# Altium project DCDCProto.PrjPCB
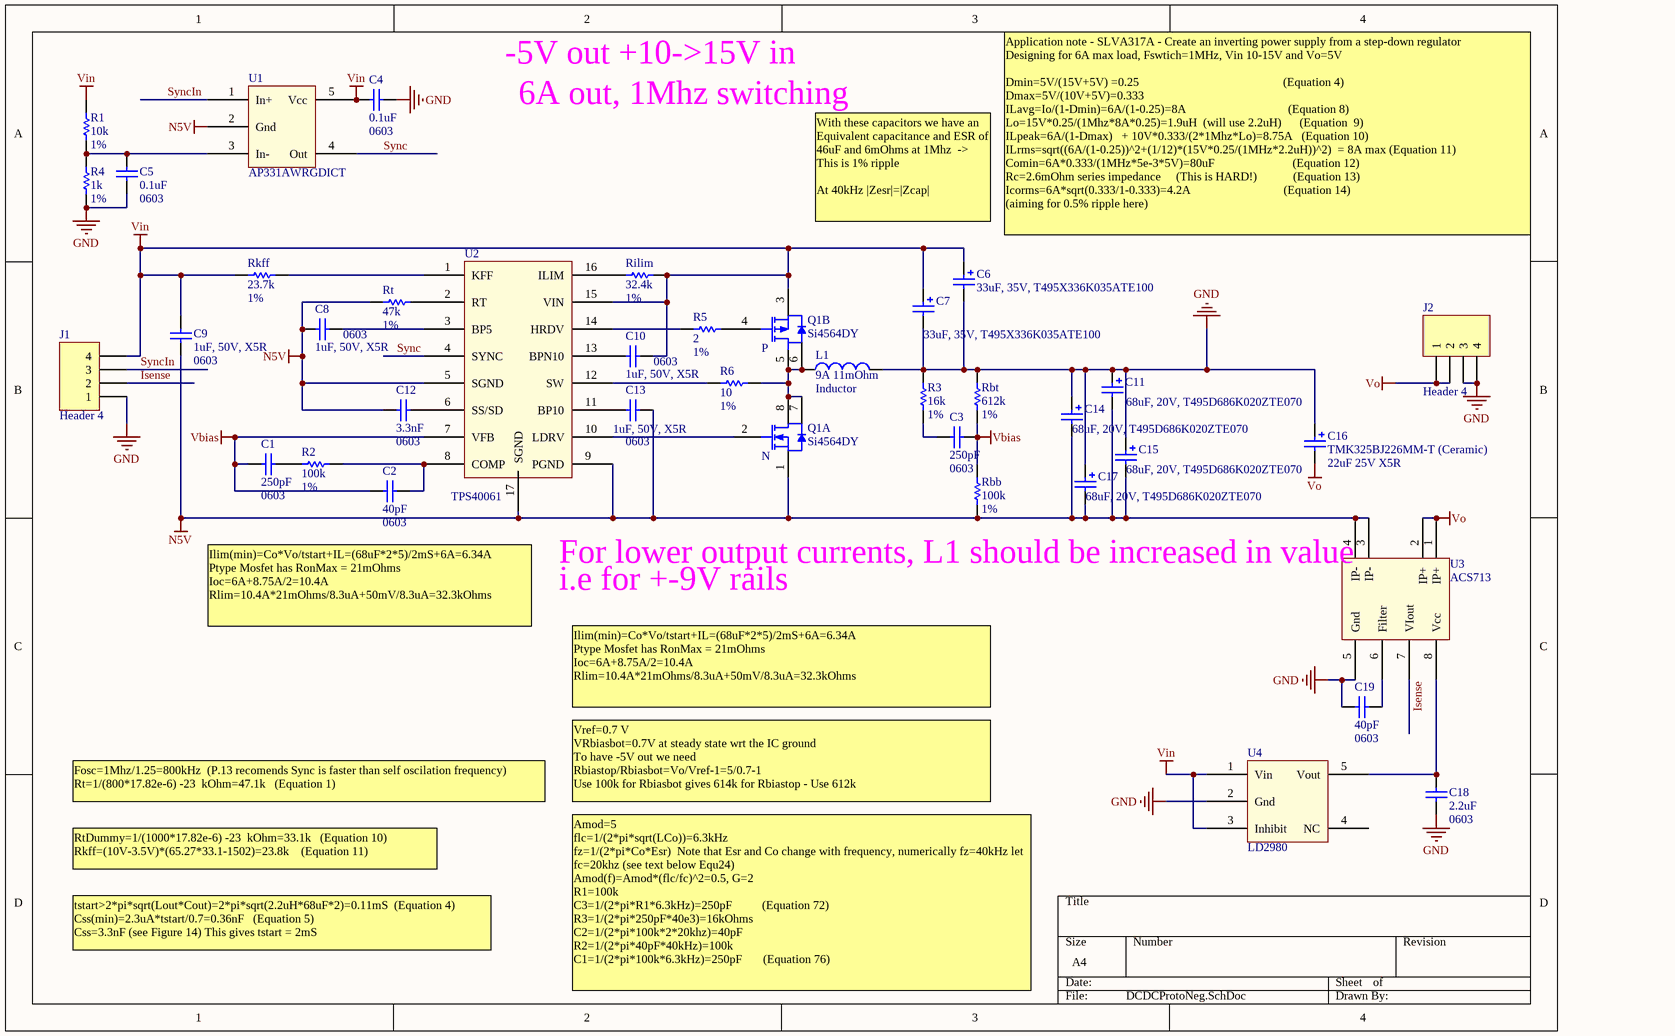
[diagram p0: DCDCProtoNeg.SchDoc]
2 sheets, 70 parts. Net scope: global (net labels, ports and power ports of the same name join across sheets).
Board file: DCDCProtoNeg.PcbDoc
Sheets:
  DCDCProtoNeg.SchDoc
  DCDCProtoPos.SchDoc

## Sheet DCDCProtoNeg.SchDoc
size A4

### Parts
(Parts that share a designator on the sheet are numbered #1, #2 ... from top to bottom, then left to right.)
C1#1  250pF  [0603]
C2#1  40pF  [0603]
C3#1  250pF  [0603]
C4#1  0.1uF  [0603]
C5  0.1uF  [0603]
C6#1  33uF, 35V, T495X336K035ATE100  [TCASE-D]
C7#1  33uF, 35V, T495X336K035ATE100  [TCASE-D]
C8#1  1uF, 50V, X5R  [0603]
C9#1  1uF, 50V, X5R  [0603]
C10#1  1uF, 50V, X5R  [0603]
C11#1  68uF, 20V, T495D686K020ZTE070  [TCASE-D]
C12#1  3.3nF  [0603]
C13#1  1uF, 50V, X5R  [0603]
C14#1  68uF, 20V, T495D686K020ZTE070  [TCASE-D]
C15#1  68uF, 20V, T495D686K020ZTE070  [TCASE-D]
C16#1  TMK325BJ226MM-T (Ceramic)  value 22uF 25V X5R  [1210]
C17#1  68uF, 20V, T495D686K020ZTE070  [TCASE-D]
C18  2.2uF  [0603]
C19  40pF  [0603]
J1#1  Header 4  [CON4M]
J2#1  Header 4  [CON4M]
L1#1  Inductor  [Wurth744311220]
Q1#1  Si4564DY  [SO8]  (parts A,B of 2)
R1#1  value 10k  Param: 1%  [0603]  (hidden comment: Res0603)
R2#1  value 100k  Param: 1%  [0603]  (hidden comment: Res0603)
R3#1  value 16k  Param: 1%  [0603]  (hidden comment: Res0603)
R4  value 1k  Param: 1%  [0603]  (hidden comment: Res0603)
R5#1  value 2  Param: 1%  [0603]  (hidden comment: Res0603)
R6#1  value 10  Param: 1%  [0603]  (hidden comment: Res0603)
Rbb#1  value 100k  Param: 1%  [0603]  (hidden comment: Res0603)
Rbt#1  value 612k  Param: 1%  [0603]  (hidden comment: Res0603)
Rilim#1  value 32.4k  Param: 1%  [0603]  (hidden comment: Res0603)
Rkff#1  value 23.7k  Param: 1%  [0603]  (hidden comment: Res0603)
Rt#1  value 47k  Param: 1%  [0603]  (hidden comment: Res0603)
U1#1  AP331AWRGDICT  [SOT23-5]
U2#1  TPS40061  [TSOP65P640X120_HS-16N]
U3  ACS713  [SO8]
U4  LD2980  [SOT23-5]

### Nets
GND: C4#1.2 C5.1 C6#1.2 C7#1.2 C11#1.1 C14#1.1 C15#1.1 C16#1.1 C17#1.1 C18.1 C19.2 J1#1.1 J2#1.3 J2#1.4 L1#1.2 R3#1.2 R4.1 Rbt#1.2 U3.5(Gnd) U4.2(Gnd)
N5V: C8#1.2 C9#1.1 C11#1.2 C12#1.1 C13#1.2 C14#1.2 C15#1.2 C17#1.2 Q1#1.1(S1) Rbb#1.1 Rt#1.1 U1#1.2(Gnd) U2#1.5(SGND) U2#1.9(PGND) U2#1.17(SGND) U3.3(IP-) U3.4(IP-)
Vbias: C1#1.2 C2#1.2 C3#1.1 Rbb#1.2 Rbt#1.1 U2#1.7(VFB)
Vin: C4#1.1 C6#1.1 C7#1.1 C9#1.2 C10#1.1 J1#1.4 Q1#1.3(S2) R1#1.2 Rilim#1.2 Rkff#1.1 U1#1.5(Vcc) U2#1.15(VIN) U4.1(Vin) U4.3(Inhibit)
Vo: C16#1.2 J2#1.1 J2#1.2 U3.1(IP+) U3.2(IP+)
Isense: J1#1.2 U3.7(VIout)
Sync: U1#1.4(Out) U2#1.4(SYNC)
SyncIn: J1#1.3 U1#1.1(In+)
NetC1#1_1: C1#1.1 R2#1.2
NetC2#1_1: C2#1.1 R2#1.1 U2#1.8(COMP)
NetC3#1_2: C3#1.2 R3#1.1
NetC5_2: C5.2 R1#1.1 R4.2 U1#1.3(In-)
NetC8#1_1: C8#1.1 U2#1.3(BP5)
NetC10#1_2: C10#1.2 U2#1.13(BPN10)
NetC12#1_2: C12#1.2 U2#1.6(SS/SD)
NetC13#1_1: C13#1.1 U2#1.11(BP10)
NetC18_2: C18.2 U3.8(Vcc) U4.5(Vout)
NetC19_1: C19.1 U3.6(Filter)
NetL1#1_1: L1#1.1 Q1#1.5(D2) Q1#1.6(D2) Q1#1.7(D1) Q1#1.8(D1) R6#1.2
NetQ1#1_2: Q1#1.2(G1) U2#1.10(LDRV)
NetQ1#1_4: Q1#1.4(G2) R5#1.2
NetR5#1_1: R5#1.1 U2#1.14(HRDV)
NetR6#1_1: R6#1.1 U2#1.12(SW)
NetRilim#1_1: Rilim#1.1 U2#1.16(ILIM)
NetRkff#1_2: Rkff#1.2 U2#1.1(KFF)
NetRt#1_2: Rt#1.2 U2#1.2(RT)

Not connected (* = marked no-connect by the designer): U4 4(NC)

### Notes on the sheet
- -5V out +10->15V in
- 6A out, 1Mhz switching
- With these capacitors we have an Equivalent capacitance and ESR of 46uF and 6mOhms at 1Mhz  -> This is 1% ripple
  At 40kHz |Zesr|=|Zcap|
- Application note - SLVA317A - Create an inverting power supply from a step-down regulator
  Designing for 6A max load, Fswtich=1MHz, Vin 10-15V and Vo=5V
  Dmin=5V/(15V+5V) =0.25                                                (Equation 4)
  Dmax=5V/(10V+5V)=0.333
  ILavg=Io/(1-Dmin)=6A/(1-0.25)=8A                                  (Equation 8)
  Lo=15V*0.25/(1Mhz*8A*0.25)=1.9uH  (will use 2.2uH)      (Equation  9)
  ILpeak=6A/(1-Dmax)   + 10V*0.333/(2*1Mhz*Lo)=8.75A   (Equation 10)
  ILrms=sqrt((6A/(1-0.25))^2+(1/12)*(15V*0.25/(1MHz*2.2uH))^2)  = 8A max (Equation 11)
  Comin=6A*0.333/(1MHz*5e-3*5V)=80uF                          (Equation 12)
  Rc=2.6mOhm series impedance     (This is HARD!)            (Equation 13)
  Icorms=6A*sqrt(0.333/1-0.333)=4.2A                               (Equation 14)
  (aiming for 0.5% ripple here)
- (near U3) For lower output currents, L1 should be increased in value
- Ilim(min)=Co*Vo/tstart+IL=(68uF*2*5)/2mS+6A=6.34A
  Ptype Mosfet has RonMax = 21mOhms
  Ioc=6A+8.75A/2=10.4A
  Rlim=10.4A*21mOhms/8.3uA+50mV/8.3uA=32.3kOhms
- i.e for +-9V rails
- Fosc=1Mhz/1.25=800kHz  (P.13 recomends Sync is faster than self oscilation frequency)
  Rt=1/(800*17.82e-6) -23  kOhm=47.1k   (Equation 1)
- Vref=0.7 V
  VRbiasbot=0.7V at steady state wrt the IC ground
  To have -5V out we need
  Rbiastop/Rbiasbot=Vo/Vref-1=5/0.7-1
  Use 100k for Rbiasbot gives 614k for Rbiastop - Use 612k
- RtDummy=1/(1000*17.82e-6) -23  kOhm=33.1k   (Equation 10)
  Rkff=(10V-3.5V)*(65.27*33.1-1502)=23.8k    (Equation 11)
- tstart>2*pi*sqrt(Lout*Cout)=2*pi*sqrt(2.2uH*68uF*2)=0.11mS  (Equation 4)
  Css(min)=2.3uA*tstart/0.7=0.36nF   (Equation 5)
  Css=3.3nF (see Figure 14) This gives tstart = 2mS
- Amod=5
  flc=1/(2*pi*sqrt(LCo))=6.3kHz
  fz=1/(2*pi*Co*Esr)  Note that Esr and Co change with frequency, numerically fz=40kHz let fc=20khz (see text below Equ24)
  Amod(f)=Amod*(flc/fc)^2=0.5, G=2
  R1=100k
  C3=1/(2*pi*R1*6.3kHz)=250pF          (Equation 72)
  R3=1/(2*pi*250pF*40e3)=16kOhms
  C2=1/(2*pi*100k*2*20khz)=40pF
  R2=1/(2*pi*40pF*40kHz)=100k
  C1=1/(2*pi*100k*6.3kHz)=250pF       (Equation 76)
- (in symbol Si4564DY, part A) N
- (in symbol Si4564DY, part B) P
- (in symbol Wurth744311220) 9A 11mOhm

### Library data of the parts
C1#1 C2#1 C3#1 C12#1 C19 = Cap0603: Capacitor, Ceramic, 0603; TechInf: *; Param1: *
C4#1 C5 C9#1 C18 = Cap0603: UMK107BJ105KA-T; TechInf: *; Param1: *
C6#1 C7#1 C11#1 C14#1 C15#1 C17#1 = CapPol3: CAP TANT 68UF 20V 10% 2917 70mOhm; Manufacturer: Kemet; Footprint: 7343-31 (EIA)
  C6#1 C7#1: Manufacturers P/N: T495X336K035ATE100
  C11#1 C14#1 C15#1 C17#1: Manufacturers P/N: T495D686K020ZTE070
C8#1 C10#1 C13#1 = Cap0603: Capacitor, Ceramic, 0603 - UMK107BJ105KA-T; TechInf: *; Param1: *
C16#1 = Cap Pol3: CAP CER 100UF 10V X5R 1210 20%; Manufacturer: Taiyo Yuden; Manufacturers P/N: LMK325BJ107MM-T; Published: 8-Jun-2000; Publisher: Altium Limited; PackageDescription: Chip Capacitor
J1#1 J2#1 = Header 4: Header, 0.1"  4-Pin straight; LatestRevisionDate: 17-Jul-2002; LatestRevisionNote: Re-released for DXP Platform.; Publisher: Altium Limited
L1#1 = Wurth744311220
R1#1 R2#1 R3#1 R4 R5#1 R6#1 Rbb#1 Rbt#1 Rilim#1 Rkff#1 Rt#1 = Res0603: Resistor; Param1: 100ppm/C; TechInfo: *
U2#1 = TPS40061PWPR: Buck Controller
U3 = ACS713: Hall effect current sensor 0-20A
U4 = LD2980: Regulator

## Sheet DCDCProtoPos.SchDoc
size A4
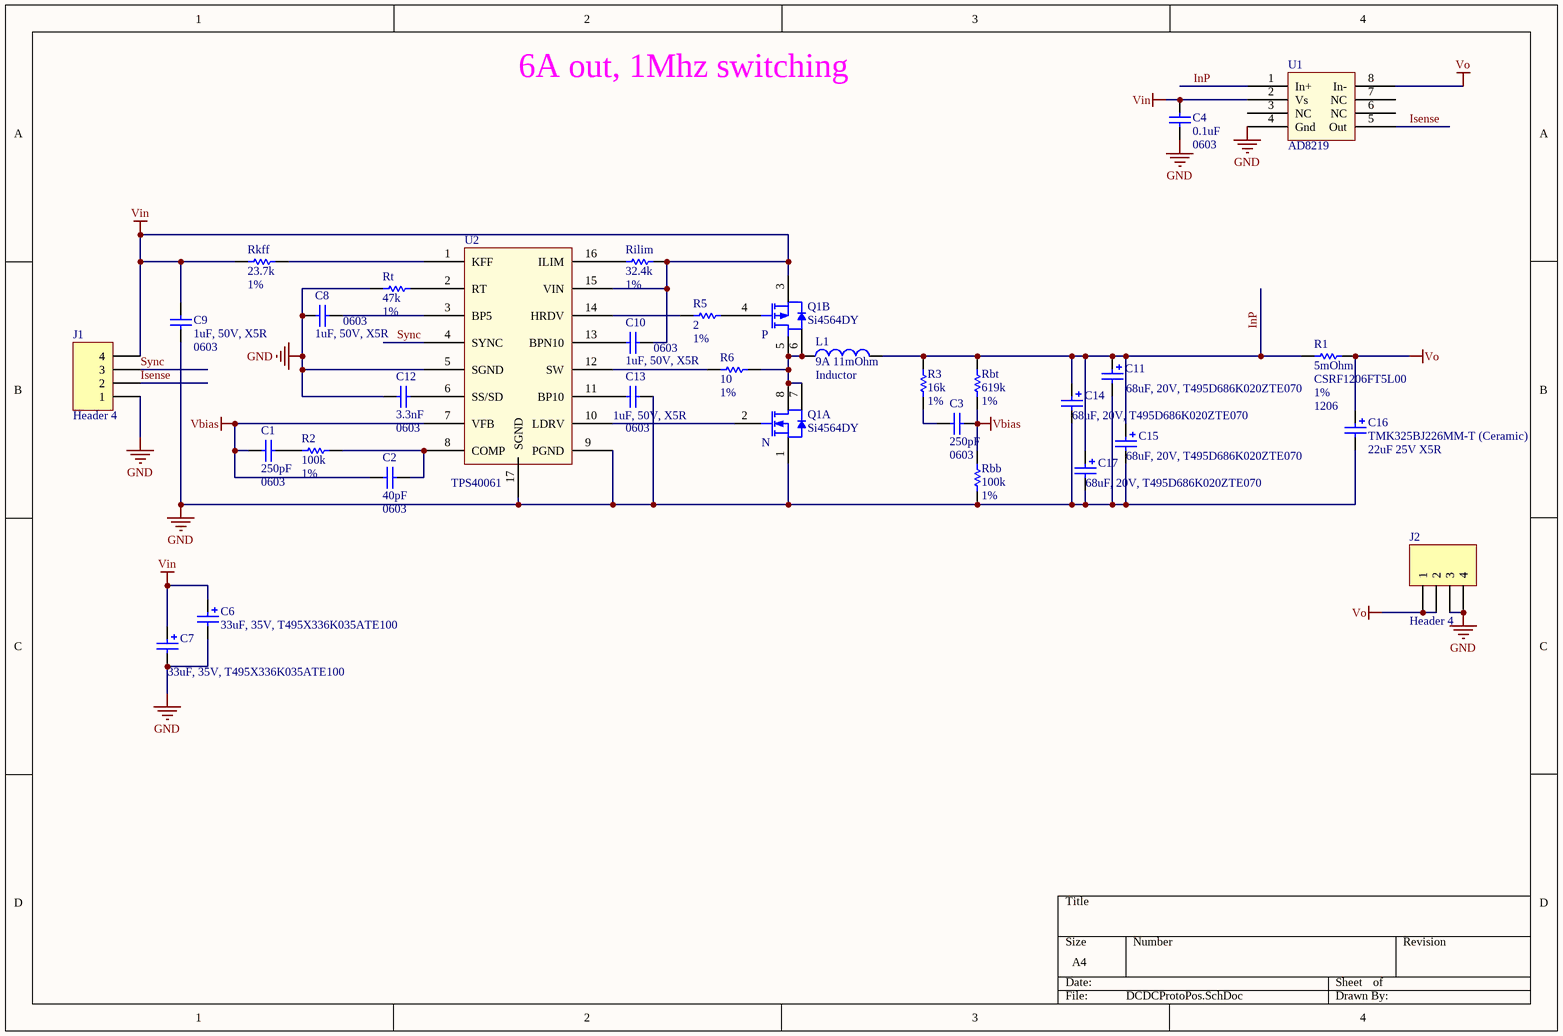
[diagram p1: DCDCProtoPos.SchDoc]

### Parts
(Parts that share a designator on the sheet are numbered #1, #2 ... from top to bottom, then left to right.)
C1#2  250pF  [0603]
C2#2  40pF  [0603]
C3#2  250pF  [0603]
C4#2  0.1uF  [0603]
C6#2  33uF, 35V, T495X336K035ATE100  [TCASE-D]
C7#2  33uF, 35V, T495X336K035ATE100  [TCASE-D]
C8#2  1uF, 50V, X5R  [0603]
C9#2  1uF, 50V, X5R  [0603]
C10#2  1uF, 50V, X5R  [0603]
C11#2  68uF, 20V, T495D686K020ZTE070  [TCASE-D]
C12#2  3.3nF  [0603]
C13#2  1uF, 50V, X5R  [0603]
C14#2  68uF, 20V, T495D686K020ZTE070  [TCASE-D]
C15#2  68uF, 20V, T495D686K020ZTE070  [TCASE-D]
C16#2  TMK325BJ226MM-T (Ceramic)  value 22uF 25V X5R  [1210]
C17#2  68uF, 20V, T495D686K020ZTE070  [TCASE-D]
J1#2  Header 4  [CON4M]
J2#2  Header 4  [CON4M]
L1#2  Inductor  [Wurth744311220]
Q1#2  Si4564DY  [SO8]  (parts A,B of 2)
R1#2  5mOhm  value CSRF1206FT5L00  Param: 1%  [1206]
R2#2  value 100k  Param: 1%  [0603]  (hidden comment: Res0603)
R3#2  value 16k  Param: 1%  [0603]  (hidden comment: Res0603)
R5#2  value 2  Param: 1%  [0603]  (hidden comment: Res0603)
R6#2  value 10  Param: 1%  [0603]  (hidden comment: Res0603)
Rbb#2  value 100k  Param: 1%  [0603]  (hidden comment: Res0603)
Rbt#2  value 619k  Param: 1%  [0603]  (hidden comment: Res0603)
Rilim#2  value 32.4k  Param: 1%  [0603]  (hidden comment: Res0603)
Rkff#2  value 23.7k  Param: 1%  [0603]  (hidden comment: Res0603)
Rt#2  value 47k  Param: 1%  [0603]  (hidden comment: Res0603)
U1#2  AD8219  [MSOP-8]
U2#2  TPS40061  [TSOP65P640X120_HS-16N]

### Nets
GND: C4#2.2 C6#2.2 C7#2.2 C8#2.2 C9#2.1 C11#2.2 C12#2.1 C13#2.2 C14#2.2 C15#2.2 C16#2.2 C17#2.2 J1#2.1 J2#2.3 J2#2.4 Q1#2.1(S1) Rbb#2.1 Rt#2.1 U1#2.4(Gnd) U2#2.5(SGND) U2#2.9(PGND) U2#2.17(SGND)
Vbias: C1#2.2 C2#2.2 C3#2.1 Rbb#2.2 Rbt#2.1 U2#2.7(VFB)
Vin: C4#2.1 C6#2.1 C7#2.1 C9#2.2 C10#2.1 J1#2.4 Q1#2.3(S2) Rilim#2.2 Rkff#2.1 U1#2.2(Vs) U2#2.15(VIN)
Vo: C16#2.1 J2#2.1 J2#2.2 R1#2.2 U1#2.8(In-)
InP: C11#2.1 C14#2.1 C15#2.1 C17#2.1 L1#2.2 R1#2.1 R3#2.2 Rbt#2.2 U1#2.1(In+)
Isense: J1#2.2 U1#2.5(Out)
Sync: J1#2.3 U2#2.4(SYNC)
NetC1#2_1: C1#2.1 R2#2.2
NetC2#2_1: C2#2.1 R2#2.1 U2#2.8(COMP)
NetC3#2_2: C3#2.2 R3#2.1
NetC8#2_1: C8#2.1 U2#2.3(BP5)
NetC10#2_2: C10#2.2 U2#2.13(BPN10)
NetC12#2_2: C12#2.2 U2#2.6(SS/SD)
NetC13#2_1: C13#2.1 U2#2.11(BP10)
NetL1#2_1: L1#2.1 Q1#2.5(D2) Q1#2.6(D2) Q1#2.7(D1) Q1#2.8(D1) R6#2.2
NetQ1#2_2: Q1#2.2(G1) U2#2.10(LDRV)
NetQ1#2_4: Q1#2.4(G2) R5#2.2
NetR5#2_1: R5#2.1 U2#2.14(HRDV)
NetR6#2_1: R6#2.1 U2#2.12(SW)
NetRilim#2_1: Rilim#2.1 U2#2.16(ILIM)
NetRkff#2_2: Rkff#2.2 U2#2.1(KFF)
NetRt#2_2: Rt#2.2 U2#2.2(RT)

Not connected (* = marked no-connect by the designer): U1#2 3(NC) 6(NC) 7(NC)

### Notes on the sheet
- 6A out, 1Mhz switching
- (in symbol Si4564DY, part A) N
- (in symbol Si4564DY, part B) P
- (in symbol Wurth744311220) 9A 11mOhm

### Library data of the parts
C1#2 C2#2 C3#2 C4#2 C12#2 = Cap0603: Capacitor, Ceramic, 0603; TechInf: *; Param1: *
C6#2 C7#2 C11#2 C14#2 C15#2 C17#2 = CapPol3: as C6#1 on sheet DCDCProtoNeg; Footprint: 7343-31 (EIA)
  C6#2 C7#2: Manufacturers P/N: T495X336K035ATE100
  C11#2 C14#2 C15#2 C17#2: Manufacturers P/N: T495D686K020ZTE070
C8#2 C10#2 C13#2 = Cap0603: as C8#1 on sheet DCDCProtoNeg; TechInf: *; Param1: *
C9#2 = Cap0603: UMK107BJ105KA-T; TechInf: *; Param1: *
C16#2 = Cap Pol3: as C16#1 on sheet DCDCProtoNeg; Published: 8-Jun-2000; Publisher: Altium Limited; PackageDescription: Chip Capacitor
J1#2 J2#2 = Header 4: Header, 0.1"  4-Pin straight; LatestRevisionDate: 17-Jul-2002; LatestRevisionNote: Re-released for DXP Platform.; Publisher: Altium Limited
L1#2 = Wurth744311220
R1#2 = Res1206: Resistor; Param1: 100ppm/C; TechInfo: *
R2#2 R3#2 R5#2 R6#2 Rbb#2 Rbt#2 Rilim#2 Rkff#2 Rt#2 = Res0603: Resistor; Param1: 100ppm/C; TechInfo: *
U1#2 = AD8219: Current sense
U2#2 = TPS40061PWPR: Buck Controller

## Nets that join several sheets
GND: DCDCProtoNeg (20 pins), DCDCProtoPos (22 pins)
Vbias: DCDCProtoNeg (6 pins), DCDCProtoPos (6 pins)
Vin: DCDCProtoNeg (14 pins), DCDCProtoPos (11 pins)
Vo: DCDCProtoNeg (5 pins), DCDCProtoPos (5 pins)
Isense: DCDCProtoNeg (J1#1.2 U3.7), DCDCProtoPos (J1#2.2 U1#2.5)
Sync: DCDCProtoNeg (U1#1.4 U2#1.4), DCDCProtoPos (J1#2.3 U2#2.4)